# EAGLE board orbiphone (EAGLE 9.6.2)
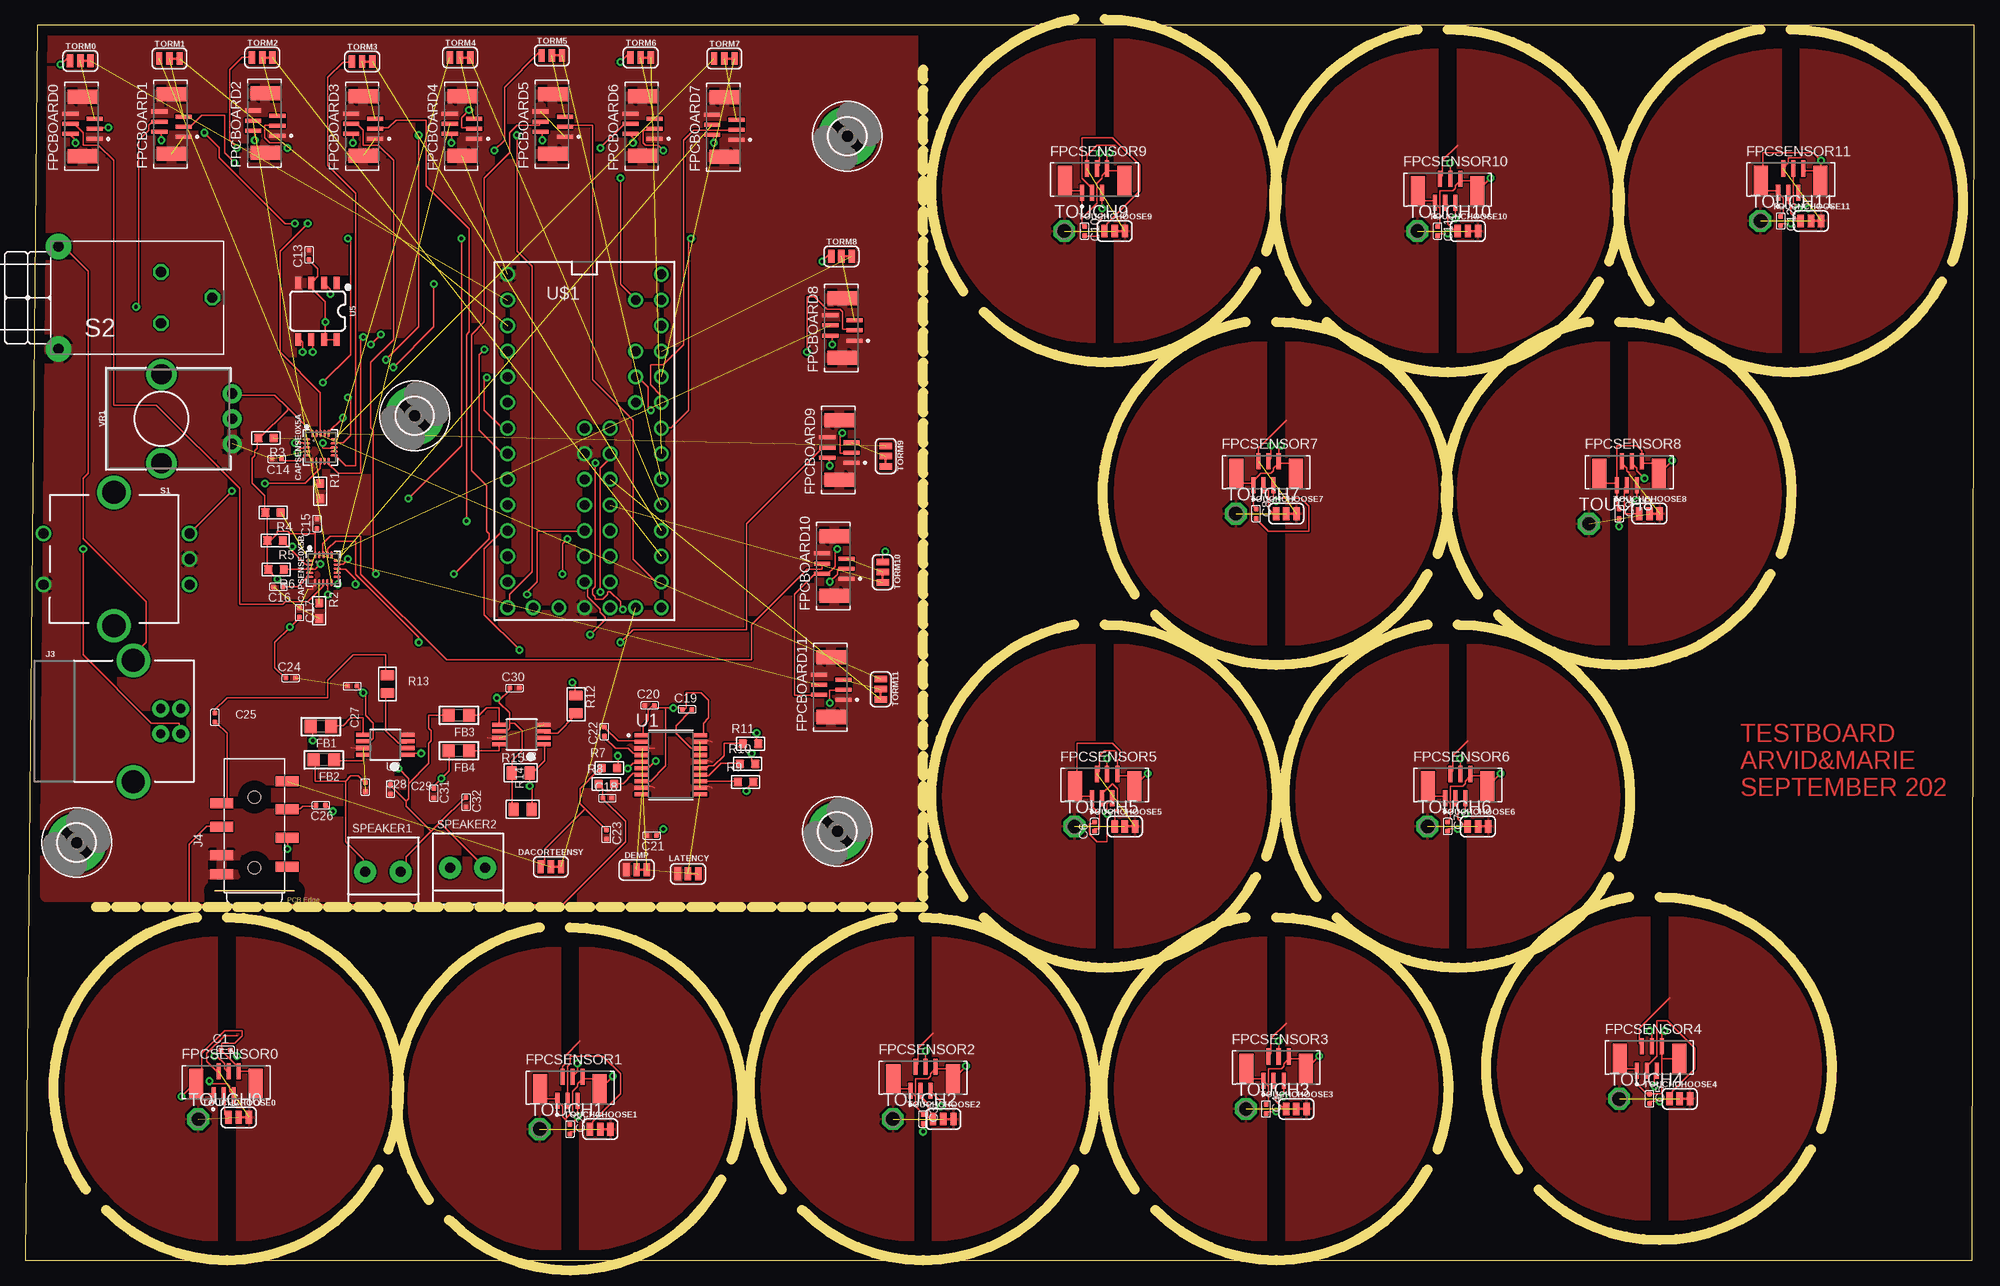
[diagram p1: board, top side]
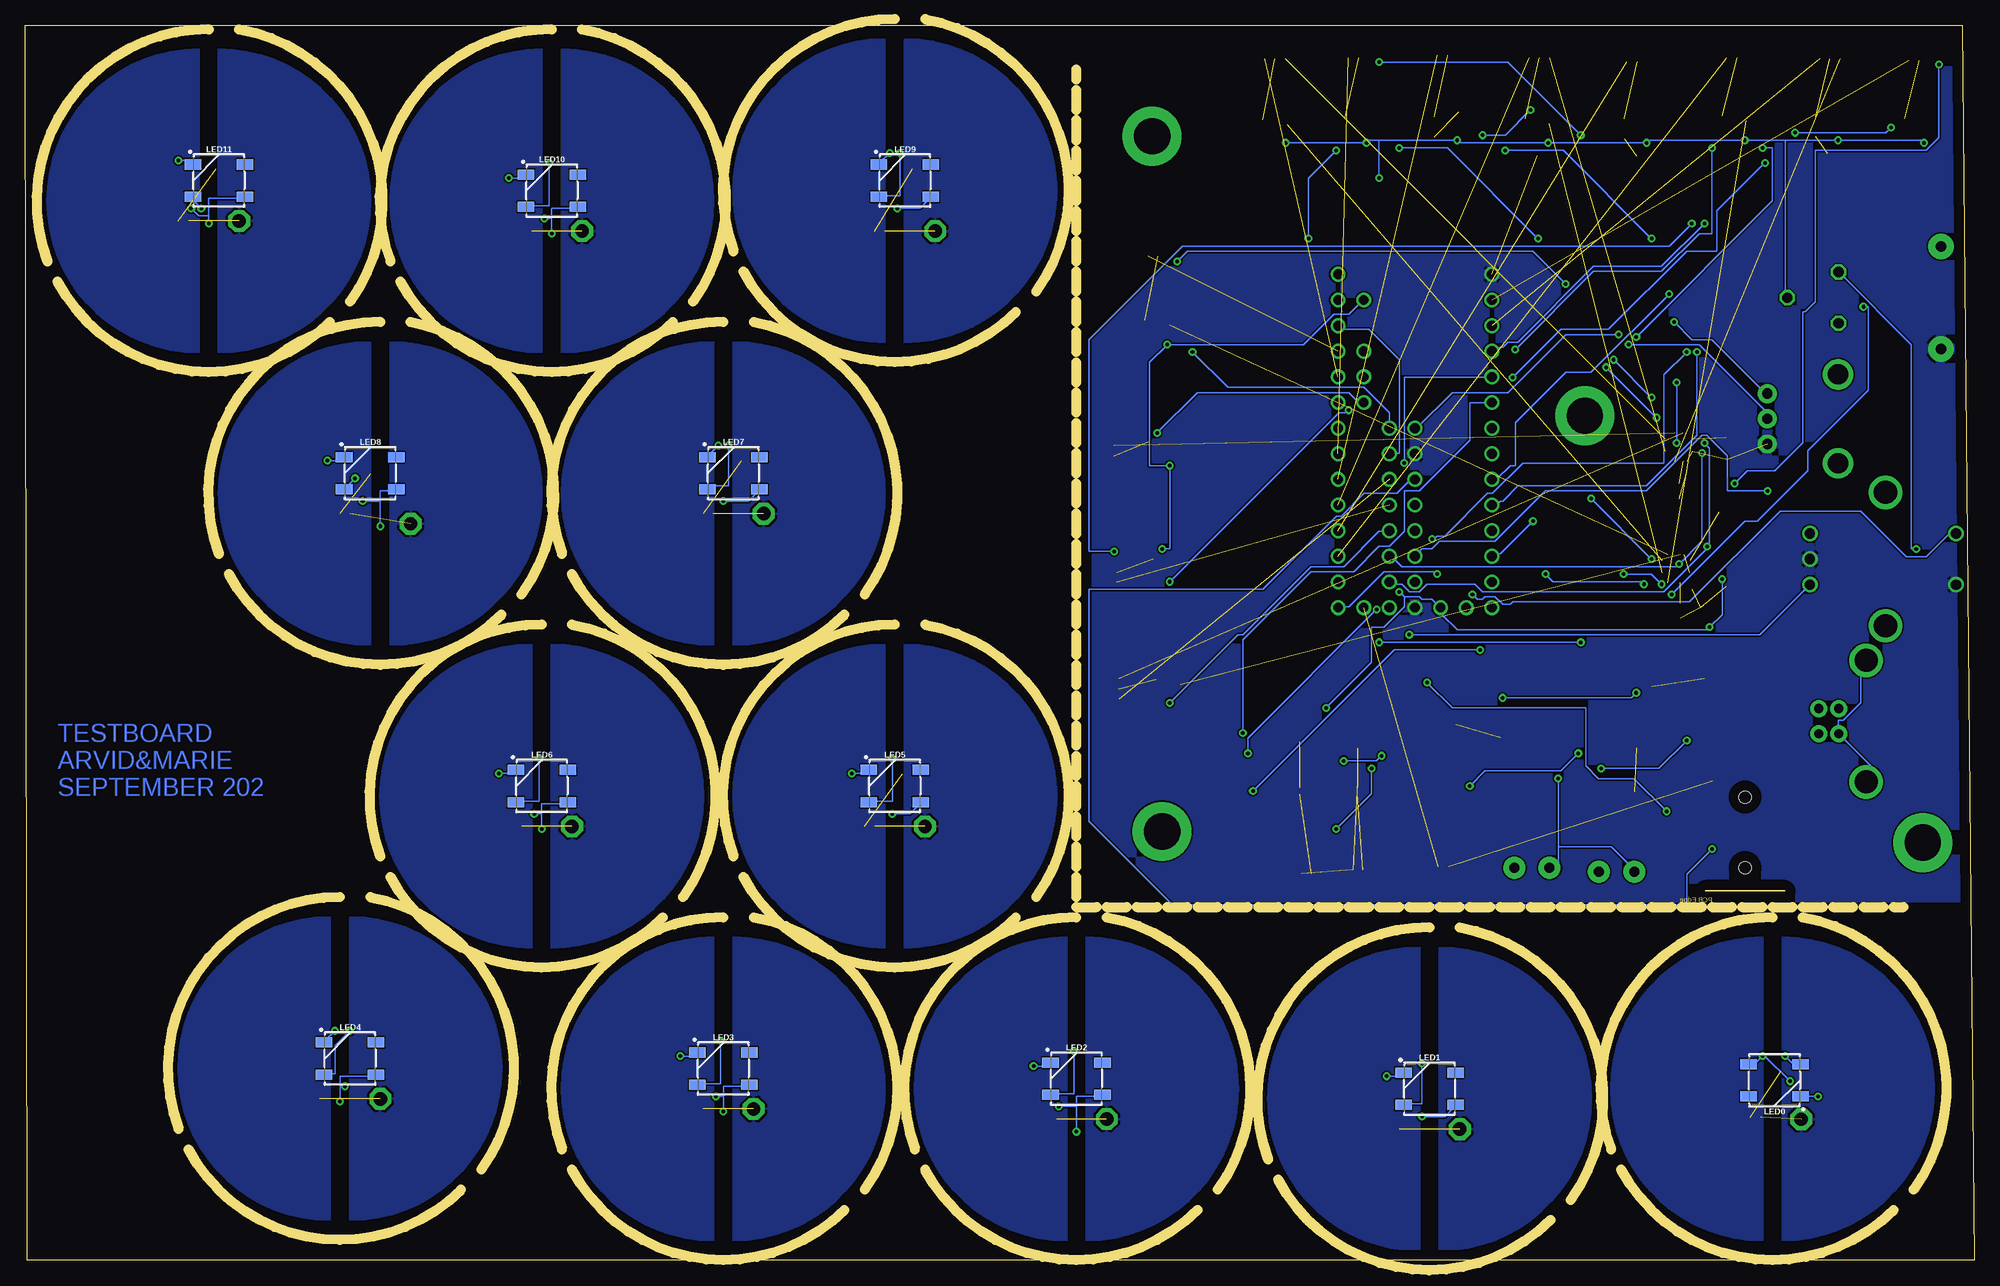
[diagram p2: board, bottom side, seen from below]

Size 193.2 x 122.4 mm. Coordinates in mm from the lower left corner, seen from the top.
Outline: 0,0 193,0 193.2,122.4 1.2,122.4 0,0
Copper layers (1*16): Top 0.035mm / dielectric 1.5mm / Bottom 0.035mm
Design rules "default": minimum track width 6mil, minimum drill 0.35mm, track to track 6mil, track to pad 6mil, pad to pad 6mil, via to via 6mil, smd to smd 6mil, copper to edge 40mil, drill to drill 6mil, minimum pad ring 10mil, minimum via ring 8mil, stop-mask expansion 4mil, vias tented up to drill 0mil, thermal gap 10mil
Milling: 92 lines

## Footprints (pad centres in the part's own frame; a part is rotated, then mirrored left to right if it is on the bottom)
C0402 = smd 0.5 x 0.5: 1 0,0.463; 2 0,-0.463
QFN-20 = smd 0.75 x 0.195: 1 -1.367,0.8; 2 -1.367,0.4; 3 -1.367,0; 4 -1.367,-0.4; 5 -1.367,-0.8; 11 1.375,-0.8; 12 1.375,-0.4; 13 1.375,0; 14 1.375,0.4; 15 1.375,0.8 | smd 0.195 x 0.75: 6 -0.795,-1.372; 7 -0.395,-1.372; 8 0.005,-1.372; 9 0.405,-1.372; 10 0.805,-1.372; 16 0.81,1.372; 17 0.41,1.372; 18 0.01,1.372; 19 -0.39,1.372; 20 -0.79,1.372
SMT-JUMPER_3_1-NC_TRACE_SILK = smd 0.635 x 1.27: 1 -1.016,0; 2 0,0; 3 1.016,0
_0805 = smd 1.2 x 1.3: 1 -1.016,0; 2 1.016,0
TE_1734742-6 = smd 0.4 x 1.6: 1 -1.25,-1.2; 2 -0.75,1.2; 3 -0.25,-1.2; 4 0.25,1.2; 5 0.75,-1.2; 6 1.25,1.2 | smd 1.4 x 2.9: S1 -2.95,0; S2 2.95,0
3,6-PAD = drill 3.6 pad 5.842: B3,6 0,0
USB-B-PTH = drill 0.914 pad 1.676: D+ 4,1.25; D- 5.981,1.25; GND 4,-1.25; VBUS 5.981,-1.25 | drill 2.286: SHLD1 1.282,-6.02; SHLD2 1.282,6.02
AUDIO8P-SMD-3.5-14.5X6X5MM = smd 1 x 2.25: 1 3.05,3.24; 2 4.95,3.24; 3 7.75,3.24; 4 12.26,-3.24; 5 3.81,-3.24; 6 6.66,-3.24; 7 9.51,-3.24; 8 10.1,3.24 | hole 1.2: 3.7,0; 10.7,0
WS2812B = smd 1.651 x 1: 1 2.577,-1.6; 2 2.577,1.6; 3 -2.577,1.6; 4 -2.577,-1.6
R0603 = smd 0.889 x 0.889: 1 0,0.762; 2 0,-0.762
R0805 = smd 1.397 x 1.016: 1 0,0.889; 2 0,-0.889
ROTARY_ENC_PLAIN = drill 1.016: A 7.493,-2.54; B 7.493,2.54; C 7.493,0; SW+ -6.985,2.54; SW- -6.985,-2.54 | drill 2.286: P$3 0,6.604; P$4 0,-6.604
316-917 = drill 1.016 octagon: 1 10.16,2.54; 2 15.24,0; 3 10.16,-2.54 | drill 1.016 pad 2.54: B 0,-5.08; B1 0,5.08
TERMBLOCK_1X2-3.5MM = drill 1 pad 2.184: 1 1.8,0; 2 -1.7,0
P1-13 = drill 1.321 pad 2.159 octagon: TP 0,0
SOP65P640X120-20N = smd 1.57 x 0.41: 1 -2.87,2.925; 2 -2.87,2.275; 3 -2.87,1.625; 4 -2.87,0.975; 5 -2.87,0.325; 6 -2.87,-0.325; 7 -2.87,-0.975; 8 -2.87,-1.625; 9 -2.87,-2.275; 10 -2.87,-2.925; 11 2.87,-2.925; 12 2.87,-2.275; 13 2.87,-1.625; 14 2.87,-0.975; 15 2.87,-0.325; 16 2.87,0.325; 17 2.87,0.975; 18 2.87,1.625; 19 2.87,2.275; 20 2.87,2.925
MSOP8_0.65MM = smd 0.4 x 1.4: 1 -0.975,-2.2; 2 -0.325,-2.2; 3 0.325,-2.2; 4 0.975,-2.2; 5 0.975,2.2; 6 0.325,2.2; 7 -0.325,2.2; 8 -0.975,2.2
SO08 = smd 0.6 x 1.2: 1 -1.905,-2.8; 2 -0.635,-2.8; 3 0.635,-2.8; 4 1.905,-2.8; 5 1.905,2.8; 6 0.635,2.8; 7 -0.635,2.8; 8 -1.905,2.8
TEENSY_3.0-3.2_ALL_PINS_&_PADS = drill 0.965: 0 -7.62,13.97; 1 -7.62,11.43; 2 -7.62,8.89; 3 -7.62,6.35; 3.3V 7.62,11.43; 3.3V1 -2.54,-16.51; 3.3V2 2.54,-1.27; 4 -7.62,3.81; 5 -7.62,1.27; 6 -7.62,-1.27; 7 -7.62,-3.81; 8 -7.62,-6.35; 9 -7.62,-8.89; 10 -7.62,-11.43; 11 -7.62,-13.97; 12 -7.62,-16.51; 13 7.62,-16.51; 14/A0 7.62,-13.97; 15/A1 7.62,-11.43; 16/A2 7.62,-8.89; 17/A3 7.62,-6.35; 18/A4 7.62,-3.81; 19/A5 7.62,-1.27; 20/A6 7.62,1.27; 21/A7 7.62,3.81; 22/A8 7.62,6.35; 23/A9 7.62,8.89; 24 0,-3.81; 25 0,-6.35; 26 0,-8.89; 27 0,-11.43; 28 0,-13.97; 29 2.54,-13.97; 30 2.54,-11.43; 31 2.54,-8.89; 32 2.54,-6.35; 33 2.54,-3.81; A10 5.08,6.35; A11 5.08,3.81; A12 0,1.27; A13 2.54,1.27; AGND 7.62,13.97; AREF 5.08,8.89; GND -7.62,16.51; GND1 0,-16.51; GND2 0,-1.27; PGM 2.54,-16.51; RESET/DAC 5.08,-16.51; VBAT -5.08,-16.51; VIN 7.62,16.51; VUSB 5.08,13.97
POT-PTH-ALPS-KIT = drill 1 pad 1.88: P$1 7,-2.5; P$2 7,0; P$3 7,2.5 | drill 2: P$4 0,-4.4; P$5 0,4.4

## Placement (x,y rotation side)
C1  1UF 6.3V  [C0402]  19.86,20.85 90 top
C2  1UF 6.3V  [C0402]  54,13 0 top
C3  1UF 6.3V  [C0402]  89,14 0 top
C4  1UF 6.3V  [C0402]  123,15 0 top
C5  1UF 6.3V  [C0402]  161,16 0 top
C6  1UF 6.3V  [C0402]  106,43 180 top
C7  1UF 6.3V  [C0402]  141,43 0 top
C8  1UF 6.3V  [C0402]  122,74 0 top
C9  1UF 6.3V  [C0402]  158,74 0 top
C10  1UF 6.3V  [C0402]  105,102 0 top
C11  1UF 6.3V  [C0402]  140,102 0 top
C12  1UF 6.3V  [C0402]  174,103 0 top
C13  0.1UF 6.3V  [C0402]  28.13,99.66 180 top
C14  0.1UF 6.3V  [C0402]  24.94,79.41 270 top
C15  0.1UF 6.3V  [C0402]  28.92,73.01 180 top
C16  0.1UF 6.3V  [C0402]  25.09,66.74 270 top
C17  0.1UF 6.3V  [C0402]  27.18,64.2 0 top
C18  2n2  [C0402]  57.7,45.8 90 top
C19  100nF 6.3V  [C0402]  65.6,54.6 90 top
C20  100nF 6.3V  [C0402]  61.9,55 90 top
C21  2u2  [C0402]  62.1,42.1 270 top
C22  2u2  [C0402]  57.4,52.4 180 top
C23  2n2  [C0402]  57.6,42.2 0 top
C24  100nF 6.3V  [C0402]  26.3,57.7 90 top
C25  1UF  [C0402]  18.8,53.8 0 top
C26  1UF  [C0402]  29.3,45.1 270 top
C27  10UF  [C0402]  32.4,56.9 270 top
C28  220pF  [C0402]  33.7,46.9 0 top
C29  220pF  [C0402]  36.2,46.7 0 top
C30  10UF  [C0402]  48.5,56.7 90 top
C31  220pF  [C0402]  40.5,46.3 0 top
C32  220pF  [C0402]  43.7,45.4 0 top
CAPSENSE0X5A  MPR121  [QFN-20]  29.26,80.57 0 top
CAPSENSE0X5B  MPR121  [QFN-20]  29.55,68.54 0 top
DACORTEENSY  JUMPER-SMT_3_1-NC_TRACE_SILK  [SMT-JUMPER_3_1-NC_TRACE_SILK]  52.1,39 0 top
DEMP  JUMPER-SMT_3_1-NC_TRACE_SILK  [SMT-JUMPER_3_1-NC_TRACE_SILK]  60.6,38.7 0 top
FB1  Ferrite  [_0805]  29.3,52.9 180 top
FB2  Ferrite  [_0805]  29.6,49.6 180 top
FB3  Ferrite  [_0805]  43,54 180 top
FB4  Ferrite  [_0805]  43,50.5 180 top
FPCBOARD0  1734742-6  [TE_1734742-6]  5.68,112.38 90 top
FPCBOARD1  1734742-6  [TE_1734742-6]  14.5,112.6 90 top
FPCBOARD2  1734742-6  [TE_1734742-6]  23.8,112.7 90 top
FPCBOARD3  1734742-6  [TE_1734742-6]  33.5,112.4 90 top
FPCBOARD4  1734742-6  [TE_1734742-6]  43.3,112.4 90 top
FPCBOARD5  1734742-6  [TE_1734742-6]  52.3,112.6 90 top
FPCBOARD6  1734742-6  [TE_1734742-6]  61.2,112.4 90 top
FPCBOARD7  1734742-6  [TE_1734742-6]  69.3,112.3 90 top
FPCBOARD8  1734742-6  [TE_1734742-6]  81,92.4 90 top
FPCBOARD9  1734742-6  [TE_1734742-6]  80.7,80.3 90 top
FPCBOARD10  1734742-6  [TE_1734742-6]  80.2,68.8 90 top
FPCBOARD11  1734742-6  [TE_1734742-6]  79.9,56.8 90 top
FPCSENSOR0  1734742-6  [TE_1734742-6]  19.91,17.54 0 top
FPCSENSOR1  1734742-6  [TE_1734742-6]  54,17 0 top
FPCSENSOR2  1734742-6  [TE_1734742-6]  89,18 0 top
FPCSENSOR3  1734742-6  [TE_1734742-6]  124,19 0 top
FPCSENSOR4  1734742-6  [TE_1734742-6]  161,20 0 top
FPCSENSOR5  1734742-6  [TE_1734742-6]  107,47 0 top
FPCSENSOR6  1734742-6  [TE_1734742-6]  142,47 0 top
FPCSENSOR7  1734742-6  [TE_1734742-6]  123,78 0 top
FPCSENSOR8  1734742-6  [TE_1734742-6]  159,78 0 top
FPCSENSOR9  1734742-6  [TE_1734742-6]  106,107 0 top
FPCSENSOR10  1734742-6  [TE_1734742-6]  141,106 0 top
FPCSENSOR11  1734742-6  [TE_1734742-6]  175,107 0 top
H1  MOUNT-PAD-ROUND3.6  [3,6-PAD]  5.1,41.4 180 top
H3  MOUNT-PAD-ROUND3.6  [3,6-PAD]  80.5,42.5 180 top
H4  MOUNT-PAD-ROUND3.6  [3,6-PAD]  38.6,83.7 180 top
H5  MOUNT-PAD-ROUND3.6  [3,6-PAD]  81.5,111.4 180 top
J3  USB_B_PTH  [USB-B-PTH]  9.44,53.43 0 top
J4  PJ-3536-L6S  [AUDIO8P-SMD-3.5-14.5X6X5MM]  22.72,35.21 90 top
LATENCY  JUMPER-SMT_3_1-NC_TRACE_SILK  [SMT-JUMPER_3_1-NC_TRACE_SILK]  65.7,38.3 0 top
LED0  WS2812B  [WS2812B]  19.81,17.85 180 bottom
LED1  WS2812B  [WS2812B]  54,17 0 bottom
LED2  WS2812B  [WS2812B]  89,18 0 bottom
LED3  WS2812B  [WS2812B]  124,19 0 bottom
LED4  WS2812B  [WS2812B]  161,20 0 bottom
LED5  WS2812B  [WS2812B]  107,47 0 bottom
LED6  WS2812B  [WS2812B]  142,47 0 bottom
LED7  WS2812B  [WS2812B]  123,78 0 bottom
LED8  WS2812B  [WS2812B]  159,78 0 bottom
LED9  WS2812B  [WS2812B]  106,107 0 bottom
LED10  WS2812B  [WS2812B]  141,106 0 bottom
LED11  WS2812B  [WS2812B]  174,107 0 bottom
R1  75K  [R0603]  29.25,76.23 180 top
R2  75K  [R0603]  29.15,64.37 180 top
R3  10K  [R0603]  23.87,81.5 90 top
R4  10K  [R0603]  24.57,74.12 90 top
R5  10K  [R0603]  24.77,71.34 90 top
R6  10K  [R0603]  24.87,68.46 90 top
R7  470  [R0603]  57.9,48.8 270 top
R8  470  [R0603]  57.6,47.2 270 top
R9  22R  [R0603]  71.4,47.4 270 top
R10  22R  [R0603]  71.6,49.2 270 top
R11  22R  [R0603]  71.9,51.2 270 top
R12  100R  [R0805]  54.6,55.1 0 top
R13  100R  [R0805]  35.9,57.1 0 top
R14  10K  [R0805]  49.3,44.7 90 top
R15  10K  [R0805]  49.1,48.3 90 top
S1  ENCODER-SWITCH  [ROTARY_ENC_PLAIN]  8.8,69.5 0 top
S2  [316-917]  3.3,95.4 0 top
SPEAKER1  [TERMBLOCK_1X2-3.5MM]  35.4,38.5 0 top
SPEAKER2  [TERMBLOCK_1X2-3.5MM]  43.8,38.9 0 top
TORM0  JUMPER-SMT_3_1-NC_TRACE_SILK  [SMT-JUMPER_3_1-NC_TRACE_SILK]  5.47,118.87 0 top
TORM1  JUMPER-SMT_3_1-NC_TRACE_SILK  [SMT-JUMPER_3_1-NC_TRACE_SILK]  14.3,119.1 0 top
TORM2  JUMPER-SMT_3_1-NC_TRACE_SILK  [SMT-JUMPER_3_1-NC_TRACE_SILK]  23.5,119.2 0 top
TORM3  JUMPER-SMT_3_1-NC_TRACE_SILK  [SMT-JUMPER_3_1-NC_TRACE_SILK]  33.4,118.8 0 top
TORM4  JUMPER-SMT_3_1-NC_TRACE_SILK  [SMT-JUMPER_3_1-NC_TRACE_SILK]  43.1,119.2 0 top
TORM5  JUMPER-SMT_3_1-NC_TRACE_SILK  [SMT-JUMPER_3_1-NC_TRACE_SILK]  52.2,119.4 0 top
TORM6  JUMPER-SMT_3_1-NC_TRACE_SILK  [SMT-JUMPER_3_1-NC_TRACE_SILK]  61,119.2 0 top
TORM7  JUMPER-SMT_3_1-NC_TRACE_SILK  [SMT-JUMPER_3_1-NC_TRACE_SILK]  69.3,119.1 0 top
TORM8  JUMPER-SMT_3_1-NC_TRACE_SILK  [SMT-JUMPER_3_1-NC_TRACE_SILK]  80.9,99.5 0 top
TORM9  JUMPER-SMT_3_1-NC_TRACE_SILK  [SMT-JUMPER_3_1-NC_TRACE_SILK]  85.3,79.7 270 top
TORM10  JUMPER-SMT_3_1-NC_TRACE_SILK  [SMT-JUMPER_3_1-NC_TRACE_SILK]  85,68.2 270 top
TORM11  JUMPER-SMT_3_1-NC_TRACE_SILK  [SMT-JUMPER_3_1-NC_TRACE_SILK]  84.8,56.6 270 top
TOUCH0  TPPAD1-13  [P1-13]  17.16,13.99 0 top
TOUCH1  TPPAD1-13  [P1-13]  51,13 0 top
TOUCH2  TPPAD1-13  [P1-13]  86,14 0 top
TOUCH3  TPPAD1-13  [P1-13]  121,15 0 top
TOUCH4  TPPAD1-13  [P1-13]  158,16 0 top
TOUCH5  TPPAD1-13  [P1-13]  104,43 0 top
TOUCH6  TPPAD1-13  [P1-13]  139,43 0 top
TOUCH7  TPPAD1-13  [P1-13]  120,74 0 top
TOUCH8  TPPAD1-13  [P1-13]  155,73 0 top
TOUCH9  TPPAD1-13  [P1-13]  103,102 0 top
TOUCH10  TPPAD1-13  [P1-13]  138,102 0 top
TOUCH11  TPPAD1-13  [P1-13]  172,103 0 top
TOUCHCHOOSE0  JUMPER-SMT_3_1-NC_TRACE_SILK  [SMT-JUMPER_3_1-NC_TRACE_SILK]  21.16,14.17 0 top
TOUCHCHOOSE1  JUMPER-SMT_3_1-NC_TRACE_SILK  [SMT-JUMPER_3_1-NC_TRACE_SILK]  57,13 0 top
TOUCHCHOOSE2  JUMPER-SMT_3_1-NC_TRACE_SILK  [SMT-JUMPER_3_1-NC_TRACE_SILK]  91,14 0 top
TOUCHCHOOSE3  JUMPER-SMT_3_1-NC_TRACE_SILK  [SMT-JUMPER_3_1-NC_TRACE_SILK]  126,15 0 top
TOUCHCHOOSE4  JUMPER-SMT_3_1-NC_TRACE_SILK  [SMT-JUMPER_3_1-NC_TRACE_SILK]  164,16 0 top
TOUCHCHOOSE5  JUMPER-SMT_3_1-NC_TRACE_SILK  [SMT-JUMPER_3_1-NC_TRACE_SILK]  109,43 0 top
TOUCHCHOOSE6  JUMPER-SMT_3_1-NC_TRACE_SILK  [SMT-JUMPER_3_1-NC_TRACE_SILK]  144,43 0 top
TOUCHCHOOSE7  JUMPER-SMT_3_1-NC_TRACE_SILK  [SMT-JUMPER_3_1-NC_TRACE_SILK]  125,74 0 top
TOUCHCHOOSE8  JUMPER-SMT_3_1-NC_TRACE_SILK  [SMT-JUMPER_3_1-NC_TRACE_SILK]  161,74 0 top
TOUCHCHOOSE9  JUMPER-SMT_3_1-NC_TRACE_SILK  [SMT-JUMPER_3_1-NC_TRACE_SILK]  108,102 0 top
TOUCHCHOOSE10  JUMPER-SMT_3_1-NC_TRACE_SILK  [SMT-JUMPER_3_1-NC_TRACE_SILK]  143,102 0 top
TOUCHCHOOSE11  JUMPER-SMT_3_1-NC_TRACE_SILK  [SMT-JUMPER_3_1-NC_TRACE_SILK]  177,103 0 top
U1  PCM5102APWR  [SOP65P640X120-20N]  64,49.1 0 top
U2  PAM8302AASCR  [MSOP8_0.65MM]  35.7,51.1 90 top
U3  PAM8302AASCR  [MSOP8_0.65MM]  49.2,52.1 90 top
U5  4MB Flash  [SO08]  28.98,94.06 180 top
U$1  TEENSY_3.1-3.2_ALL_PINS&PADS  [TEENSY_3.0-3.2_ALL_PINS_&_PADS]  55.44,81.2 0 top
VR1  10k  [POT-PTH-ALPS-KIT]  13.5,83.4 0 top

## Tracks (layer width: path | path; a pad name or v marks a point on that pad's centre or on a via)
3.3V  (via drill 0.35)  (3 unrouted)
  Top 0.152: C24.1 25.75,57.75 24.75,58.75 24.75,61.25 v26.25,62.75 27,63.5 C17.2 | 28.75,72 28.75,70 CAPSENSE0X5B.20 | 28.75,72 28.75,72.5 C15.1 | R5.1 24,71.25 24,68.5 R6.1 24.25,68.25 v25,67.5 | R5.1 24,71.5 24,74 R4.1 23.75,74.25 23.75,75.75 22.5,77 22.5,79.5 22.75,79.75 22.75,80.25 23,80.5 23,81.5 R3.1 23.25,81.5 26,84.25 26,84.5 | 28.75,72 26.25,72 26,72.25 25,72.25 25,72 24.25,71.25 R5.1 | U5.8 30.75,91.25 29.75,91.25 U5.7 29.75,91.5 v29.75,93 29.75,95 28.5,96.25 28.5,96.75 U5.3 28.5,97 29,97.5 29,98.25 28.25,99 C13.1 | 26,84.5 24.75,85.75 20.5,85.75 VR1.P$3 | 26,84.5 28.5,82 CAPSENSE0X5A.20 | U1.1 61.25,52 61.25,53 61.75,53.5 61.75,54.5 62.25,55 C20.2 62.5,55 62.5,54.75 63.5,54.75 | 63.5,54.75 v64.25,54.75 65,54.75 C19.1 65.25,54.5 65.5,54.75 65.5,56.25 67,56.25 67.75,55.5 67.75,53.75 67.25,53.25 67.25,52.25 67,52 U1.20 | 63.5,54.75 63.5,49 62,47.5 61.25,47.5 U1.8 | v57,66.25 57,78.5 57.75,79.25 57.75,79.75 U$1.3.3V2
  Bottom 0.152: v25,67.5 25,64 v26.25,62.75 26.5,62.5 51.25,62.5 52.75,64 52.75,64.5 U$1.3.3V1 53,64.75 53.75,65.5 54.75,65.5 55,65.75 56.5,65.75 | v29.75,93 28,91.25 26,91.25 20.75,86 20.5,86 VR1.P$3 | v57,66.25 56.5,65.75 | U$1.3.3V 63,92.5 62.75,92.25 60,92.25 57,89.25 57,80 57.75,80 U$1.3.3V2 | v64.25,54.75 59.75,59.25 59.75,62.75 58.5,62.75 56.5,64.75 56.5,65.75
5V  (via drill 0.35)
  Top 0.152: 79,68 78.25,68 76.25,66 76.25,56 78.5,56 FPCBOARD11.2 | v79.75,78.75 79.75,79.25 79.5,79.5 FPCBOARD9.2 | v80.5,70.5 80.25,70.25 80.25,68.75 79.5,68 79,68 | 79,68 FPCBOARD10.2 | v80,90.75 80,91.5 FPCBOARD8.2 | v5,110.75 5,111 4.5,111.5 FPCBOARD0.2 | v13.5,111 13.5,111.75 FPCBOARD1.2 | v22.75,111 22.75,112 FPCBOARD2.2 | v32.5,110.75 32.5,111.5 FPCBOARD3.2 | v42.25,110.75 42.25,111.5 FPCBOARD4.2 | v51.25,111 51.25,111.75 FPCBOARD5.2 | v60.25,110.75 60.25,111.25 60,111.5 FPCBOARD6.2 | v68.25,110.75 68.25,111.5 FPCBOARD7.2 | v59,107.25 59,96.75 60.5,95.25 U$1.VUSB
  Bottom 0.152: v80.5,70.5 79.75,70.5 v79.75,78.75 81.75,78.75 81.75,89 v80,90.75 66.5,90.75 63.5,93.75 62,93.75 60.75,95 U$1.VUSB | v5,110.75 5.25,111 v13.5,111 18.75,111 | 18.75,111 v22.75,111 32.25,111 v32.5,110.75 v42.25,110.75 51,110.75 v51.25,111 59,111 | 59,111 60,111 v60.25,110.75 v68.25,110.75 | 18.75,111 18.75,95.5 S2.2 | 59,111 v59,107.25
AMPL
  Top 0.152: C25.2 19,53.25 20,52.25 20,45.75 19.5,45.25 J4.8
AMPR
  Top 0.152: C26.2 28.75,45 27.5,45 27.25,44.75 26,44.75 J4.7
AUDIOOUTTEENSY  (1 unrouted)
ENCA  (via drill 0.35)
  Top 0.152: v56,62 57.5,63.5 57.5,63.75 57,64.25 57,64.5 55.75,65.75 55.75,66.75 55.5,67 U$1.28
  Bottom 0.152: v56,62 21.25,62 16.5,66.75 S1.A
ENCB  (via drill 0.35)
  Top 0.152: v20.5,76.25 16.5,72.25 S1.B
  Bottom 0.152: v20.5,76.25 24.5,76.25 24.5,79.75 26.5,81.75 27,81.75 32.5,76.25 42.5,76.25 47.5,71.25 53,71.25 53.75,70.5 54.75,70.5 55.25,70 U$1.27
ENCBUT  (via drill 0.35)
  Top 0.152: v49.75,66 49.75,66.25 50.75,67.25 50.75,72.25 55.25,72.25 U$1.26
  Bottom 0.152: v49.75,66 49.25,65.5 48.75,65.5 48.5,65.75 47.5,65.75 46.75,65 46,65 45.75,65.25 28.25,65.25 19.25,74.25 11.25,74.25 6.75,69.75 4.75,69.75 2.5,72 2,72 S1.SW+
GND  (17 unrouted)
  Top 0.152: CAPSENSE0X5B.6 28.75,67 28.5,66.75 28.5,66.5 28,66.49 | CAPSENSE0X5A.6 28.5,79 28.5,78.75 28.46,78.27 | U2.7 33.5,50.75 32.75,50.75 32.33,50.77 | U2.4 38,52.25 37.9,52.28 | U3.7 47,51.75 46.25,51.75 45.83,51.77 | U3.4 51.5,53.25 51.4,53.28 | U1.9 61.25,47 62,47 62.36,46.83 | U1.3 61.25,50.75 62,50.75 62.36,50.73 | U1.12 67,47 67.75,47 68.1,46.83 | U1.16 67,49.5 67.75,49.5 68.1,49.42 | U1.19 67,51.5 67.75,51.5 68.1,51.38
  pour Top: 2,122 88,122 88,36 2,36
  pour Bottom: 2,122 87,122 87,36 1,36 1,122
I2SLRCK  (via drill 0.35)
  Top 0.152: v72.5,52.25 72.5,51.25 R11.1
  Bottom 0.152: v72.5,52.25 72.5,61.5 65.75,68.25 61.5,68.25 59,70.75 58,70.75 56.5,72.25 56.5,76.25 55,76.25 50,81.25 50,85 48,85 U$1.4
I2STX  (via drill 0.35)
  Top 0.152: v72,50.25 72,49.5 72.25,49.25 R10.1 | v59.25,64.5 59,64.75 59,65.25 58,66.25 57.75,66.25 57.75,66 57.25,65.5 56.5,65.5 56.5,65.75 56.25,66 56.25,66.5 56.5,66.75 v56.5,79
  Bottom 0.152: v72,50.25 72,51.75 v59.25,64.5 | v56.5,79 56.5,87.5 48,87.5 U$1.3
IRQA  (1 unrouted)
IRQB  (1 unrouted)
IS2BCLK  (via drill 0.35)
  Top 0.152: v71.5,46.5 71.5,46.75 72,47.25 R9.1 | v49,60.5 45.5,64 45.5,70.5 47.25,72.25 47.75,72.25 U$1.9
  Bottom 0.152: v71.5,46.5 57.5,60.5 v49,60.5
JACKSENS  (via drill 0.35)
  Top 0.152: v26,40.75 26,41.75 J4.6
  Bottom 0.152: v26,40.75 28.5,38.25 28.5,35.25 79.5,35.25 87.75,43.5 87.75,66.5 70.5,66.5 63.25,73.75 62.75,73.75 60.5,76 57.25,76 56,77.25 55.5,77.25 U$1.24
LED0  (via drill 0.35)
  Top 0.152: v8.25,112.25 7,112.25 FPCBOARD0.3 | v17.75,111.75 19.25,110.25 19.25,109.25 25.75,102.75 v26.75,102.75
  Bottom 0.152: v8.25,112.25 8.75,111.75 v17.75,111.75 | v26.75,102.75 31,98.5 37.75,98.5 45.25,91 46.25,91 46.75,90.5 47,90.5 47.25,90.25 47.75,90.25 U$1.2
LED1  (via drill 0.35)
  Top 0.152: v20.75,108.75 19.75,109.75 19.75,113.5 17.5,113.5 16.5,112.5 15.75,112.5 FPCBOARD1.3 | v45.75,87.5 45.5,87.25 45.5,84.25 47.25,82.5 47.75,82.5 U$1.5
  Bottom 0.152: v20.75,108.75 25.5,104 25.5,100 28.5,100 36.25,92.25 41,92.25 v45.75,87.5
LED2  (via drill 0.35)
  Top 0.152: v26,110.25 25.5,110.75 24.25,110.75 23.75,111.25 23.75,112.5 25,112.5 FPCBOARD2.3 | v45.5,90.25 45,89.75 45,82.25 47.25,80 47.75,80 U$1.6
  Bottom 0.152: v26,110.25 26,101.75 27.25,101.75 31,98 37.75,98 v45.5,90.25
LED3  (via drill 0.35)
  Top 0.152: v43.75,73.25 43.75,91.75 44,92 44,102.25 39.75,106.5 39.75,113 36.75,113 36,112.25 34.75,112.25 FPCBOARD3.3
  Bottom 0.152: v43.75,73.25 47,70 47.75,70 U$1.10
LED4  (via drill 0.35)
  Top 0.152: v44,114 43.25,113.25 43.25,112.25 44.5,112.25 FPCBOARD4.3 | v48.75,111.5 48.75,100 50.25,98.5 50.25,68.25 48,66 48,64.75 U$1.12
  Bottom 0.152: v44,114 46.5,111.5 v48.75,111.5
LED5
  Top 0.152: FPCBOARD5.3 53.5,112.5 56.25,112.5 56.25,87.25 60.25,83.25 60.25,69.5 62.5,67.25 63,67.25 U$1.14/A0
LED6  (via drill 0.35)
  Top 0.152: v63.25,110 62.75,110.5 61.5,110.5 61.25,110.75 61.25,112 62.25,112 FPCBOARD6.3 | v66,101.25 65.75,101 65.75,84.25 64,82.5 63.25,82.5 U$1.20/A6
  Bottom 0.152: v63.25,110 66,107.25 v66,101.25
LED7
  Top 0.152: FPCBOARD7.3 70.5,112 66.25,112 65.25,111 65.25,90.75 63.25,88.75 62,88.75 62,86.75 63,85.75 63,85.25 U$1.21/A7
LED8  (via drill 0.35)
  Top 0.152: v77.5,90 77.5,95.5 78.25,95.5 79.5,94.25 80.75,94.25 81,94 81,92.25 82,92.25 FPCBOARD8.3
  Bottom 0.152: v77.5,90 74,86.5 60.5,86.5 58,84 58,82.5 U$1.A13
LED9  (via drill 0.35)
  Top 0.152: v81,82 80.75,81.75 80.75,80 81.75,80 FPCBOARD9.3
  Bottom 0.152: v81,82 77,86 62,86 61.25,85.25 60.75,85.25 U$1.A11
LED10  (via drill 0.35)
  Top 0.152: v79.75,67.25 80.5,68 80.5,68.5 81.25,68.5 FPCBOARD10.3 | v62,84.25 61.75,84.5 61.75,86.5 60.75,87.5 U$1.A10
  Bottom 0.152: v79.75,67.25 63,84 62.25,84 v62,84.25
LED11  (via drill 0.35)
  Top 0.152: v79.75,55.25 79.75,56.5 81,56.5 FPCBOARD11.3
  Bottom 0.152: v79.75,55.25 73,62 72.5,62 65.75,68.75 62.5,68.75 59,72.25 58,72.25 U$1.31
LOUT  (1 unrouted)
MISO  (via drill 0.35)
  Top 0.152: v27.5,90 27.5,91 27.25,91.25 U5.5
  Bottom 0.152: v27.5,90 27.5,81.75 32.5,76.75 45.25,76.75 46.75,75.25 47,75.25 47.25,75 47.75,75 U$1.8
MOSI  (via drill 0.35)
  Top 0.152: v30.25,95.75 30.25,96.25 29.75,96.75 U5.2
  Bottom 0.152: v30.25,95.75 38,88 40.5,88 45.5,83 45.5,78.75 46,78.75 47.25,77.5 47.75,77.5 U$1.7
N$1  (via drill 0.35)
  Top 0.152: FPCSENSOR0.1 18.5,16.5 17,16.5 17,17.5 FPCSENSOR0.S1 | v15.5,16.25 16.75,17.5 FPCSENSOR0.S1 | FPCSENSOR0.S2 22.75,17.75 22.75,18.75 21.25,18.75 FPCSENSOR0.6 21,18.75 21,19.25 19.5,20.75 C1.1 19.5,21 19.5,21.5 20.75,21.5 21.5,22.25 21.5,22.75 19.75,22.75 17.5,20.5 17.5,18.25 17,17.75 FPCSENSOR0.S1
  Top 0.254: 21.18,18.74 FPCSENSOR0.6
  Bottom 0.152: v15.5,16.25 LED0.3
N$2  (via drill 0.35)
  Top 0.152: 55.25,18 56.75,18 56.75,17 FPCSENSOR1.S2 57,17 v58.25,18.25 | 53.5,14 53.25,14.25 53.25,15.25 52.75,15.75 FPCSENSOR1.1 52.75,16 51.25,16 51.25,17 FPCSENSOR1.S1 | 53.5,14 54,13.5 C2.1 | 55.25,18 54.75,17.5 54.75,17.25 54.25,16.75 54.25,14.75 53.5,14 | 55.25,18 FPCSENSOR1.6
  Bottom 0.152: v58.25,18.25 57,18.25 56.75,18.5 LED1.3
N$3  (via drill 0.35)
  Top 0.152: v21,20.25 20.5,20.75 C1.2 | FPCSENSOR0.5 20.25,16.75 20.25,17.25 20,17.5 18.25,17.5 v18.25,17.75
  Bottom 0.152: LED0.1 22.25,19.5 21.75,19.5 v21,20.25 20.75,20.25 v18.25,17.75
N$4  (via drill 0.35)
  Top 0.152: v18.75,20.25 19,20.25 19.75,19.5 19.75,19 20,18.75 FPCSENSOR0.4
  Bottom 0.152: v18.75,20.25 18,19.5 17.25,19.5 LED0.4
N$5  (via drill 0.35)
  Top 0.152: 54.5,14.25 54.5,14.5 54.75,14.75 FPCSENSOR1.5 | 54.5,14.25 54.5,12.75 54,12.75 C2.2 | 54.5,14.25 v54.75,14.25
  Bottom 0.152: v54.75,14.25 52.5,14.25 51.5,15.25 LED1.1
N$6  (via drill 0.35)
  Top 0.152: v54.75,19.5 54.75,18.75 54.25,18.25 FPCSENSOR1.4
  Bottom 0.152: v54.75,19.5 54.75,15.5 56.5,15.5 LED1.4
N$9
  Top 0.152: FPCSENSOR1.3 53.75,19.25 54,19.5 54,20.25 57.25,20.25 59,18.5 59,16.5 56.25,13.75 56.25,13.25 56,13 TOUCHCHOOSE1.1
N$10  (via drill 0.35)
  Top 0.152: 90.25,19 91.75,19 91.75,18 FPCSENSOR2.S2 92,18 v93.25,19.25 | 88.25,16.25 88.25,15.25 89,14.5 C3.1 | 88.25,16.25 87.75,16.75 FPCSENSOR2.1 87.75,17 86.25,17 86.25,18 FPCSENSOR2.S1 | 90.25,19 89.75,18.5 89.75,18.25 89.5,18 88.25,18 88.25,16.25 | 90.25,19 FPCSENSOR2.6
  Bottom 0.152: v93.25,19.25 92,19.25 91.75,19.5 LED2.3
N$11  (via drill 0.35)
  Top 0.152: v89,12.75 C3.2 | v90.75,15.25 90.75,15.75 89.75,16.75 FPCSENSOR2.5
  Bottom 0.152: 89,15.25 89,16.25 86.5,16.25 LED2.1 | 89,15.25 v89,12.75 | 89,15.25 v90.75,15.25
N$12  (via drill 0.35)
  Top 0.152: v89.25,20.75 FPCSENSOR2.4
  Bottom 0.152: v89.25,20.75 89.25,16.5 91.5,16.5 LED2.4
N$15
  Top 0.152: FPCSENSOR2.3 88.75,16.25 89.5,15.5 89.5,14.25 89.75,14 TOUCHCHOOSE2.1
N$16  (via drill 0.35)
  Top 0.152: 125.25,20 126.75,20 126.75,19 FPCSENSOR3.S2 127,19 v128.25,20.25 | 123.25,17.25 123.25,15.75 123,15.5 C4.1 | 123.25,17.25 122.75,17.75 FPCSENSOR3.1 122.75,18 121.25,18 121.25,19 FPCSENSOR3.S1 | 125.25,20 124.75,19.5 124.75,19.25 124.5,19 123.25,19 123.25,17.25 | 125.25,20 FPCSENSOR3.6
  Bottom 0.152: v128.25,20.25 127,20.25 126.75,20.5 LED3.3
N$17  (via drill 0.35)
  Top 0.152: v124,14.75 123,14.75 C4.2 | v124.75,16.25 FPCSENSOR3.5
  Bottom 0.152: 124,16.25 124,17.25 121.5,17.25 LED3.1 | 124,16.25 v124,14.75 | 124,16.25 v124.75,16.25
N$18  (via drill 0.35)
  Top 0.152: v124.25,21.75 FPCSENSOR3.4
  Bottom 0.152: v124.25,21.75 124.25,17.5 126.5,17.5 LED3.4
N$21
  Top 0.152: TOUCHCHOOSE3.1 124.75,15 124,15.75 124,17.5 123.75,17.75 FPCSENSOR3.3
N$22  (via drill 0.35)
  Top 0.152: FPCSENSOR4.S1 158.25,20 158.25,19 159.75,19 FPCSENSOR4.1 159.75,17.5 161,16.25 C5.1 161,16.5 162.25,16.5 162.25,20 | 162.25,20 FPCSENSOR4.6 162.25,22.5 v162.5,22.75 | 162.25,20 FPCSENSOR4.S2
  Bottom 0.152: v162.5,22.75 163.5,21.75 LED4.3
N$23  (via drill 0.35)
  Top 0.152: v162,15.75 161,15.75 C5.2 | v161.5,17.25 161.5,18.5 161.75,18.75 FPCSENSOR4.5
  Bottom 0.152: 162,17.25 162,18.25 158.5,18.25 LED4.1 | 162,17.25 v162,15.75 | 162,17.25 v161.5,17.25
N$24  (via drill 0.35)
  Top 0.152: FPCSENSOR4.4 161.25,22.5 v161,22.75
  Bottom 0.152: v161,22.75 162.5,21.25 162.5,18.5 163.5,18.5 LED4.4
N$27
  Top 0.152: FPCSENSOR4.3 160.75,19.25 161.75,20.25 161.75,23.75 162.75,23.75 165.5,21 165.5,19 163.25,16.75 163.25,16.25 163,16 TOUCHCHOOSE4.1
N$28  (via drill 0.35)
  Top 0.152: v111.25,48.25 110,47 FPCSENSOR5.S2 109.75,47 109.75,48 108.25,48 FPCSENSOR5.6 108.25,49.5 108.5,49.75 108.5,50.5 107.75,51.25 104.25,51.25 104.25,47 | C6.1 106,42.75 106.5,42.75 106.5,44.25 105.75,45 FPCSENSOR5.1 105.75,46 104.25,46 104.25,47 | 104.25,47 FPCSENSOR5.S1
  Bottom 0.152: v111.25,48.25 110,48.25 109.75,48.5 LED5.3
N$29  (via drill 0.35)
  Top 0.152: C6.2 106,43.25 105.5,43.25 105.5,42.25 106.25,41.5 107.25,41.5 v107.25,44.25 107.25,45.25 107.75,45.75 FPCSENSOR5.5
  Bottom 0.152: v107.25,44.25 105.5,44.25 104.5,45.25 LED5.1
N$30  (via drill 0.35)
  Top 0.152: v107.25,49.75 FPCSENSOR5.4
  Bottom 0.152: v107.25,49.75 107.25,45.5 109.5,45.5 LED5.4
N$33
  Top 0.152: FPCSENSOR5.3 106.75,46.25 107.75,47.25 108.25,46.75 108.25,44.75 108,44.5 108,43 TOUCHCHOOSE5.1
N$34  (via drill 0.35)
  Top 0.152: 143.25,48 144.75,48 144.75,47 FPCSENSOR6.S2 145,47 v146.25,48.25 | 141.25,45.25 141.25,43.75 141,43.5 C7.1 | 141.25,45.25 140.75,45.75 FPCSENSOR6.1 140.75,46 139.25,46 139.25,47 FPCSENSOR6.S1 | 143.25,48 142.75,47.5 142.75,47.25 142.5,47 141.25,47 141.25,45.25 | 143.25,48 FPCSENSOR6.6
  Bottom 0.152: v146.25,48.25 145,48.25 144.75,48.5 LED6.3
N$35  (via drill 0.35)
  Top 0.152: v142,42.75 141,42.75 C7.2 | v142.75,44.25 FPCSENSOR6.5
  Bottom 0.152: 142,44.25 142,45.25 139.5,45.25 LED6.1 | 142,44.25 v142,42.75 | 142,44.25 v142.75,44.25
N$36  (via drill 0.35)
  Top 0.152: v142.25,49.75 FPCSENSOR6.4
  Bottom 0.152: v142.25,49.75 142.25,45.5 144.5,45.5 LED6.4
N$37
  Top 0.152: C14.1 25.5,79.25 27.25,79.25 27.75,79.75 CAPSENSE0X5A.5
N$38  (1 unrouted)
N$42
  Top 0.152: S2.B1 3.5,100.25 4.25,100.25 4.25,100 6.25,98 6.25,78 5.75,77.5 5.75,71.5 12,65.25 12,61.25 10.75,60 10.75,59.5 J3.SHLD2
  Bottom 0.152: J3.SHLD1 10.5,47.5 10.25,47.5 10.25,49 13.25,52 J3.GND 13.5,52.25 13.5,53.5 13,53.5 11.25,55.25 11.25,59.25 10.75,59.25 J3.SHLD2
N$43  (via drill 0.35)
  Top 0.152: v5.75,70.5 5.75,60 12.5,53.25 15.25,53.25 15.25,52.25 J3.VBUS
  Bottom 0.152: v5.75,70.5 6.25,70.5 6.25,90.75 13.25,97.75 S2.1
N$53
  Top 0.152: C16.1 25.75,66.75 27,66.75 28,67.75 CAPSENSE0X5B.5
N$54  (1 unrouted)
N$66
  Top 0.152: R10.2 70.75,49.25 69,49.25 67.75,48 67,48 U1.14
N$67
  Top 0.152: R9.2 70.5,47.5 67,47.5 U1.13
N$68
  Top 0.152: R11.2 71,51.25 69.25,51.25 69.25,50 68.25,49 67.75,49 67.5,48.75 67,48.75 U1.15
N$69
  Top 0.152: C19.2 66,54.5 64.5,53 64.5,52.25 66,50.75 66.75,50.75 U1.18
N$70
  Top 0.152: C22.2 57.5,52.75 58.75,51.5 61,51.5 U1.2
N$71
  Top 0.152: C22.1 57.5,51.75 58.5,50.75 59.75,50.75 60.25,50.25 61,50.25 U1.4
N$72  (via drill 0.35)
  Top 0.152: v63.25,42.75 62.75,42.25 C21.1 | v59.75,48.75 60.25,49.25 61,49.25 U1.5
  Bottom 0.152: v63.25,42.75 59.75,46.25 v59.75,48.75
N$73  (via drill 0.35)
  Top 0.152: v58.75,50 58.75,49 R7.1 | v62.5,49.5 61.75,48.75 61.25,48.75 U1.6
  Bottom 0.152: v58.75,50 59.25,49.5 v62.5,49.5
N$74
  Top 0.152: R8.1 58.5,47.25 59.25,47.25 60.25,48.25 61,48.25 U1.7
N$75  (1 unrouted)
N$76  (1 unrouted)
N$77
  Top 0.152: R12.2 54.5,54 52.75,52.25 51.5,52.25 U3.3
N$78
  Top 0.152: R13.2 35.75,56 35.75,52.5 37,51.25 37.75,51.25 U2.3
N$79
  Top 0.152: FB4.1 47,50.5 U3.8
N$80
  Top 0.152: U2.8 33.5,49.5 30.75,49.5 FB2.1
N$81
  Top 0.152: U2.5 33.5,53.75 32.25,53.75 31.5,53 30.5,53 FB1.1
N$82
  Top 0.152: C25.1 18.75,54.5 20,55.75 30,55.75 30,57.5 32.5,60 35.75,60 35.75,58 R13.1
N$83
  Top 0.152: FB3.1 45,54 45.75,54.75 47,54.75 U3.5
N$84  (via drill 0.35)
  Top 0.152: v30.5,44.5 30,45 C26.1 | v54.25,57.25 54.5,57 54.5,56 R12.1
  Bottom 0.152: v30.5,44.5 33.75,47.75 37.25,47.75 38.5,49 38.5,54.75 51.75,54.75 v54.25,57.25
N$87
  Top 0.152: TOUCHCHOOSE6.1 142.75,43 142,43.75 142,45.5 141.75,45.75 FPCSENSOR6.3
N$88  (via drill 0.35)
  Top 0.152: 124.25,79 125.75,79 125.75,78 FPCSENSOR7.S2 | v124.5,80.75 124.25,80.5 FPCSENSOR7.6 124.25,79 | C8.1 122,74.5 121.75,74.75 FPCSENSOR7.1 121.75,77 | 121.75,77 120.25,77 120.25,78 FPCSENSOR7.S1 | 124.25,79 123.75,78.5 123.75,78.25 123.5,78 122.5,78 121.75,77.25 121.75,77
  Bottom 0.152: v124.5,80.75 125.5,79.75 LED7.3
N$89  (via drill 0.35)
  Top 0.152: 124,75.5 123.75,75.5 FPCSENSOR7.5 | 124,75.5 126.5,75.5 127.25,74.75 127.25,72.25 123.25,72.25 122,73.5 C8.2 | 124,75.5 v124,75.25
  Bottom 0.152: v124,75.25 121.5,75.25 120.5,76.25 LED7.1
N$90  (via drill 0.35)
  Top 0.152: v123.5,80.75 123.5,79.5 123.25,79.25 FPCSENSOR7.4
  Bottom 0.152: v123.5,80.75 123.5,76.75 125.25,76.75 125.5,76.5 LED7.4
N$93
  Top 0.152: TOUCHCHOOSE7.1 123.75,74 123.25,74.5 123.25,76.25 122.75,76.75 FPCSENSOR7.3
N$94  (via drill 0.35)
  Top 0.152: v163.25,79.25 162,78 FPCSENSOR8.S2 161.75,78 161.75,79 160.25,79 FPCSENSOR8.6 160.25,80.25 159.75,80.75 157.75,80.75 157.75,77 | C9.1 158,74.5 157.75,74.75 FPCSENSOR8.1 157.75,77 | 157.75,77 156.25,77 156.25,78 FPCSENSOR8.S1
  Bottom 0.152: v163.25,79.25 162,79.25 161.75,79.5 LED8.3
N$95  (via drill 0.35)
  Top 0.152: v158,72.75 C9.2 | v159.75,75.25 FPCSENSOR8.5
  Bottom 0.152: 158,75.25 158,76.25 156.5,76.25 LED8.1 | 158,75.25 v158,72.75 | 158,75.25 v159.75,75.25
N$96  (via drill 0.35)
  Top 0.152: v160.5,77.5 159.75,78.25 159.75,78.5 159.25,79 FPCSENSOR8.4
  Bottom 0.152: v160.5,77.5 161.5,76.5 LED8.4
N$99
  Top 0.152: TOUCHCHOOSE8.1 158.5,74 158.5,76.5 158.75,76.75 FPCSENSOR8.3
N$100  (via drill 0.35)
  Top 0.152: 107.25,108 108.75,108 108.75,107 FPCSENSOR9.S2 | v107.5,109.75 107.25,109.5 FPCSENSOR9.6 107.25,108 | 104.75,103.25 FPCSENSOR9.1 104.75,106 103.25,106 103.25,107 FPCSENSOR9.S1 | 104.75,103.25 104.75,102.75 105,102.5 C10.1 | 107.25,108 106.75,107.5 106.75,107.25 106.25,106.75 106.25,104.75 104.75,103.25
  Bottom 0.152: v107.5,109.75 108.5,108.75 LED9.3
N$101  (via drill 0.35)
  Top 0.152: FPCSENSOR9.5 v106.75,104.25 106.75,103.25 106.25,102.75 106.25,101.5 105,101.5 C10.2
  Bottom 0.152: v106.75,104.25 104.5,104.25 103.5,105.25 LED9.1
N$102  (via drill 0.35)
  Top 0.152: v106.5,109.75 106.5,108.5 106.25,108.25 FPCSENSOR9.4
  Bottom 0.152: v106.5,109.75 106.5,105.5 108.5,105.5 LED9.4
N$105
  Top 0.152: FPCSENSOR9.3 105.75,106.25 104.75,107.25 104.75,111.25 107.75,111.25 110.5,108.5 110.5,106 107.25,102.75 107.25,102.25 107,102 TOUCHCHOOSE9.1
N$106  (via drill 0.35)
  Top 0.152: 142.25,107 143.75,107 143.75,106 FPCSENSOR10.S2 144,106 v145.25,107.25 | 140.25,104.25 140.25,102.75 140,102.5 C11.1 | 140.25,104.25 139.75,104.75 FPCSENSOR10.1 139.75,105 138.25,105 138.25,106 FPCSENSOR10.S1 | 142.25,107 141.75,106.5 141.75,106.25 141.5,106 140.25,106 140.25,104.25 | 142.25,107 FPCSENSOR10.6
  Bottom 0.152: v145.25,107.25 144,107.25 143.75,107.5 LED10.3
N$107  (via drill 0.35)
  Top 0.152: v141,101.75 140,101.75 C11.2 | v141.75,103.25 FPCSENSOR10.5
  Bottom 0.152: 141,103.25 141,104.25 138.5,104.25 LED10.1 | 141,103.25 v141,101.75 | 141,103.25 v141.75,103.25
N$108  (via drill 0.35)
  Top 0.152: v141.25,108.75 FPCSENSOR10.4
  Bottom 0.152: v141.25,108.75 141.25,104.5 143.5,104.5 LED10.4
N$111
  Top 0.152: TOUCHCHOOSE10.1 141.75,102 141,102.75 141,104.5 140.75,104.75 FPCSENSOR10.3
N$112  (via drill 0.35)
  Top 0.152: FPCSENSOR11.6 176.25,108 177.75,108 177.75,107 FPCSENSOR11.S2 178,107 v178,109 177.25,109.75 172.25,109.75 172.25,107 | C12.1 174,103.5 174.25,103.75 174.25,105.25 173.75,105.75 FPCSENSOR11.1 173.75,106 172.25,106 172.25,107 | 172.25,107 FPCSENSOR11.S1
  Bottom 0.152: v178,109 177,109 176.75,108.75 LED11.3
N$113  (via drill 0.35)
  Top 0.152: v175,102.75 174,102.75 C12.2 | v176.75,104.25 176.75,104.75 175.75,105.75 FPCSENSOR11.5
  Bottom 0.152: 175,103.5 175,105.25 171.5,105.25 LED11.1 | 175,103.5 v175,102.75 | v176.75,104.25 176,103.5 175,103.5
N$114  (via drill 0.35)
  Top 0.152: FPCSENSOR11.4 175.25,104.75 v175.75,104.25
  Bottom 0.152: v175.75,104.25 176.75,105.25 LED11.4
N$117
  Top 0.152: FPCSENSOR11.3 174.75,104.75 175,104.5 175,103.75 175.75,103 TOUCHCHOOSE11.1
OUTL
  Top 0.152: 55.5,44.75 55,45.25 55,46.75 56.75,48.5 57,48.5 57,48.75 R7.2 | 55.5,44.75 57.5,42.75 C23.1 | 55.5,44.75 51.5,40.75 51.5,39.25 51.25,39 DACORTEENSY.1
OUTR
  Top 0.152: R8.2 57,47 57.25,46.75 57.25,46 C18.1 57.25,45.75 59.5,43.5 59.5,41.5 53.25,35.25 16.25,35.25 16.25,41.25 18,43 19.25,43 J4.3
POT  (via drill 0.35)
  Top 0.152: v34.25,90.75 v35.25,91.75
  Bottom 0.152: v35.25,91.75 40.5,91.75 46.25,86 51.75,86 55.25,82.5 U$1.A12 | v34.25,90.75 27.25,90.75 20.5,84 VR1.P$2
SCK  (via drill 0.35)
  Top 0.152: v28.5,90 28.5,91.25 U5.6 | v53.75,71.5 53.25,71 v53.25,68
  Bottom 0.152: v28.5,90 30.75,87.75 30.75,79 44.75,79 47.75,76 48.25,76 52.5,71.75 53.25,71.75 53.5,71.5 v53.75,71.5 | v53.25,68 53.5,68.25 58.5,68.25 62,64.75 63,64.75 U$1.13
SCL  (via drill 0.35)
  Top 0.152: 26.25,70.5 25.75,71 25.75,71.25 R5.2 | 26.25,70.5 27.75,69 28,69 CAPSENSE0X5B.2 | v26.75,81 27.75,81 CAPSENSE0X5A.2 | 26.25,70.5 v26.5,70.75
  Bottom 0.152: v26.75,81 26.25,80.5 26.25,70.75 | 26.25,70.75 30.75,66.25 48.75,66.25 49.5,67 54.25,67 55,66.25 56,66.25 56.75,67 57.75,67 U$1.29 | 26.25,70.75 v26.5,70.75
SD  (via drill 0.35)
  Top 0.152: 50.25,47 50.25,47.25 50,47.5 50,48 | 50.25,47 50.25,44.75 R14.2 | 50,48 50,48.25 R15.2 50,48 | v39.25,50.25 38,50.25 U2.1 | 50.25,47 v50,47 | 50,48 51.5,49.5 51.5,51 U3.1
  Bottom 0.152: v39.25,50.25 41,48.5 48.5,48.5 v50,47
SDA  (via drill 0.35)
  Top 0.152: R6.2 25.75,68.5 28,68.5 CAPSENSE0X5B.3 28.25,68.5 28.75,68.5 v29.25,69 | v27,80 27.25,80.25 27.25,80.5 27.75,80.5 CAPSENSE0X5A.3
  Bottom 0.152: v27,80 27,71.25 v29.25,69 29.5,68.75 56.75,68.75 57.75,69.75 U$1.30
SENS0A  (1 unrouted)
SENS0B
  Top 0.152: CAPSENSE0X5B.8 29.5,67 29.5,66.75 28,65.25 25.75,65.25 25.5,65 21.25,65 21.25,76.5 13,84.75 8.75,84.75 8.75,109 7.25,110.5 5.75,110.5 5.75,111.75 5,112.5 4.5,112.5 FPCBOARD0.4
SENS0M  (via drill 0.35)
  Top 0.152: v23.75,77 27.75,77 29.25,78.5 29.25,79 CAPSENSE0X5A.8 | v3.5,118.5 4.25,119.25 4.5,119.25 4.5,119 TORM0.1
  Bottom 0.152: v23.75,77 22.5,78.25 19.75,78.25 17,81 17,94 16.75,94 15.75,95 15.75,110 4.75,110 3.5,111.25 v3.5,118.5
SENS0T  (1 unrouted)
SENS1A  (1 unrouted)
SENS1B  (via drill 0.35)
  Top 0.152: v30,66 30,67 CAPSENSE0X5B.9 | v11,94.5 11.25,94.75 11.25,111 12.25,112 12.25,112.5 12.5,112.75 13.25,112.75 FPCBOARD1.4
  Bottom 0.152: v30,66 22.75,73.25 21.5,73.25 16.5,78.25 16.5,80.25 10.5,86.25 10.5,94.5 v11,94.5
SENS1M  (1 unrouted)
SENS1T  (1 unrouted)
SENS2A  (1 unrouted)
SENS2B  (1 unrouted)
SENS2M  (via drill 0.35)
  Top 0.152: v33.5,91.5 33.25,91.25 33.25,78 31,78 30,79 CAPSENSE0X5A.10 | v21,110.25 20.25,111 20.25,118 21.5,119.25 22.25,119.25 TORM2.1
  Bottom 0.152: v33.5,91.5 20,105 20,110.25 v21,110.25
SENS2T  (1 unrouted)
SENS3A  (1 unrouted)
SENS3B  (via drill 0.35)
  Top 0.152: v31,67 31,67.75 CAPSENSE0X5B.11 | v34.75,68 34.5,68.25 34.5,82.25 34.25,82.5 34.25,89 36.5,91.25 36.5,109 35,110.5 33.5,110.5 33.5,112 33,112.5 32.5,112.5 FPCBOARD3.4
  Bottom 0.152: v31,67 32,68 v34.75,68
SENS3M
  Top 0.152: CAPSENSE0X5A.11 30.75,79.75 31.75,78.75 32.75,78.75 32.75,105.75 30,108.5 30,117.25 31.5,118.75 32.25,118.75 TORM3.1
SENS3T  (1 unrouted)
SENS4A  (1 unrouted)
SENS4B  (1 unrouted)
SENS4M  (1 unrouted)
SENS4T  (1 unrouted)
SENS5A  (1 unrouted)
SENS5B  (via drill 0.35)
  Top 0.152: v32.75,67 32.75,67.5 31.75,68.5 31,68.5 CAPSENSE0X5B.13 | v42.5,68 46,71.5 46,72 45.75,72.25 45.75,76.75 44.25,78.25 44.25,91.75 45.5,93 45.5,107.25 48,109.75 48,111.75 48.75,112.5 51,112.5 51,112.75 FPCBOARD5.4
  Bottom 0.152: v32.75,67 33,67.25 41.75,67.25 v42.5,68
SENS5M  (via drill 0.35)
  Top 0.152: v29.5,81 29.5,80.5 30.5,80.5 CAPSENSE0X5A.13 | v29.5,87 32.25,89.75 32.25,101 v32,101.25 | v46.5,110 47.5,111 47.5,116.25 51,119.75 51.25,119.75 51.25,119.5 TORM5.1
  Bottom 0.152: v29.5,87 v29.5,81 | v32,101.25 40.75,110 v46.5,110
SENS5T  (1 unrouted)
SENS6A  (1 unrouted)
SENS6B  (via drill 0.35)
  Top 0.152: v32,69.5 31.5,69 31,69 CAPSENSE0X5B.14 | v38,75.5 43.25,80.75 v43.25,101.25 | v57,110.25 59.25,112.5 60,112.5 FPCBOARD6.4
  Bottom 0.152: v38,75.5 v32,69.5 | v43.25,101.25 52.25,110.25 v57,110.25
SENS6M  (via drill 0.35)
  Top 0.152: v32,85.5 32.25,85.25 32.25,81.75 31.5,81 30.75,81 CAPSENSE0X5A.14 | v35.75,89.25 39,92.5 v39,111.5 | v59,118.75 59.75,119.5 60,119.5 60,119.25 TORM6.1
  Bottom 0.152: v35.75,89.25 v32,85.5 | v39,111.5 46.25,118.75 v59,118.75
SENS6T  (1 unrouted)
SENS7A  (1 unrouted)
SENS7B  (1 unrouted)
SENS7M  (1 unrouted)
SENS7T  (1 unrouted)
SENS8A  (1 unrouted)
SENS8B  (1 unrouted)
SENS8M  (via drill 0.35)
  Top 0.152: v31.5,83.5 30,82 CAPSENSE0X5A.16 | v36.5,88.5 40.5,92.5 v40.5,96.75 | v79,99 79.75,99.75 80,99.75 80,99.5 TORM8.1
  Bottom 0.152: v36.5,88.5 v31.5,83.5 | v40.5,96.75 43.75,100 78,100 v79,99
SENS8T  (1 unrouted)
SENS9A  (1 unrouted)
SENS9B  (via drill 0.35)
  Top 0.152: v39,61.25 39,61.75 32.75,68 32.75,71.25 30.75,71.25 30,70.5 30,70 CAPSENSE0X5B.17 | v59,61.25 60.25,62.5 71.5,62.5 71.5,73 79,80.5 79.5,80.5 FPCBOARD9.4
  Bottom 0.152: v59,61.25 v39,61.25
SENS9M  (1 unrouted)
SENS10A  (1 unrouted)
SENS10B
  Top 0.152: FPCBOARD10.4 79,68.5 77.5,68.5 72,63 72,59.5 41.75,59.5 33.25,68 33.25,71.75 30.25,71.75 29.5,71 29.5,70 CAPSENSE0X5B.18
SENS10M  (via drill 0.35)
  Top 0.152: v28,102.75 25.25,100 25.25,90 29.25,86 29.25,82 CAPSENSE0X5A.18 | v85.25,70.25 85,70 TORM10.1
  Bottom 0.152: v28,102.75 30.25,100.5 78.5,100.5 87.75,91.25 87.75,70.25 v85.25,70.25
SENS10T  (1 unrouted)
SENS11A  (1 unrouted)
SENS11B  (1 unrouted)
SENS11M  (1 unrouted)
SENS11T  (1 unrouted)
TOUCHB0
  Top 0.152: TOUCHCHOOSE0.1 20,14.25 19.75,14.5 19.75,16.25 FPCSENSOR0.3
TOUCHPAD0  (1 unrouted)
  Top 0.152: 21,22.25 19.75,22.25 18,20.5 18,19.75 19,18.75 FPCSENSOR0.2
  pour Bottom: 21,2 21,32 arc-90 36,17 arc-90
  pour Top: 21,32 21,2 arc90 36,17 arc90
TOUCHPAD1
  Top 0.152: FPCSENSOR1.2 53.25,19.25 53.5,19.5 53.5,20.25 55,21.75
  pour Bottom: 55,1 55,31 arc-90 70,16 arc-90
  pour Top: 55,31 55,1 arc90 70,16 arc90
TOUCHPAD2
  Top 0.152: 90,22.5 88.5,21 88.5,19.5 88.25,19.25 FPCSENSOR2.2
  pour Bottom: 90,2 90,32 arc-90 105,17 arc-90
  pour Top: 90,32 90,2 arc90 105,17 arc90
TOUCHPAD3
  Top 0.152: 125,23.5 123.5,22 123.5,20.5 123.25,20.25 FPCSENSOR3.2
  pour Bottom: 125,2 125,32 arc-90 140,17 arc-90
  pour Top: 125,32 125,2 arc90 140,17 arc90
TOUCHPAD4
  Top 0.152: 163,26 160,23 160,21.5 160.25,21.25 FPCSENSOR4.2
  pour Bottom: 163,4 163,34 arc-90 178,19 arc-90
  pour Top: 163,34 163,4 arc90 178,19 arc90
TOUCHPAD5  (1 unrouted)
  Top 0.152: 108,50.5 107,50.5 106.5,50 106.5,48.5 106.25,48.25 FPCSENSOR5.2
  pour Bottom: 108,31 108,61 arc-90 123,46 arc-90
  pour Top: 108,61 108,31 arc90 123,46 arc90
TOUCHPAD6
  Top 0.152: 143,51.5 141.5,50 141.5,48.5 141.25,48.25 FPCSENSOR6.2
  pour Bottom: 143,31 143,61 arc-90 158,46 arc-90
  pour Top: 143,61 143,31 arc90 158,46 arc90
TOUCHPAD7  (1 unrouted)
  Top 0.152: FPCSENSOR7.2 122.25,80.5 125,83.25
  pour Bottom: 125,61 125,91 arc-90 140,76 arc-90
  pour Top: 125,91 125,61 arc90 140,76 arc90
TOUCHPAD8  (1 unrouted)
  Top 0.152: FPCSENSOR8.2 158.25,79 158.75,78.5 158.75,78.25 159,78 159,77.88
  pour Bottom: 159,61 159,91 arc-90 174,76 arc-90
  pour Top: 159,91 159,61 arc90 174,76 arc90
TOUCHPAD9  (1 unrouted)
  Top 0.152: FPCSENSOR9.2 105.25,109.5 106.25,110.5 108,110.5
  pour Bottom: 108,91 108,121 arc-90 123,106 arc-90
  pour Top: 108,121 108,91 arc90 123,106 arc90
TOUCHPAD10
  Top 0.152: 142,110.5 140.5,109 140.5,107.5 140.25,107.25 FPCSENSOR10.2
  pour Bottom: 142,90 142,120 arc-90 157,105 arc-90
  pour Top: 142,120 142,90 arc90 157,105 arc90
TOUCHPAD11  (1 unrouted)
  Top 0.152: FPCSENSOR11.2 174.25,108.25 174.75,108.75 174.75,109.25 176,109.25 176,109.28
  pour Top: 176,120 176,90 arc90 191,105 arc90
  pour Bottom: 176,90 176,120 arc-90 191,105 arc-90
TOUCHPOINT0  (1 unrouted)
  pour Bottom: 19,32 19,2 arc-90 4,17 arc-90
  pour Top: 19,2 19,32 arc90 4,17 arc90
TOUCHPOINT1  (1 unrouted)
  pour Bottom: 53,31 53,1 arc-90 38,16 arc-90
  pour Top: 53,1 53,31 arc90 38,16 arc90
TOUCHPOINT2  (1 unrouted)
  pour Bottom: 88,32 88,2 arc-90 73,17 arc-90
  pour Top: 88,2 88,32 arc90 73,17 arc90
TOUCHPOINT3  (1 unrouted)
  pour Bottom: 123,32 123,2 arc-90 108,17 arc-90
  pour Top: 123,2 123,32 arc90 108,17 arc90
TOUCHPOINT4  (1 unrouted)
  pour Bottom: 161,34 161,4 arc-90 146,19 arc-90
  pour Top: 161,4 161,34 arc90 146,19 arc90
TOUCHPOINT5  (1 unrouted)
  pour Bottom: 106,61 106,31 arc-90 91,46 arc-90
  pour Top: 106,31 106,61 arc90 91,46 arc90
TOUCHPOINT6  (1 unrouted)
  pour Bottom: 141,61 141,31 arc-90 126,46 arc-90
  pour Top: 141,31 141,61 arc90 126,46 arc90
TOUCHPOINT7  (1 unrouted)
  pour Bottom: 123,91 123,61 arc-90 108,76 arc-90
  pour Top: 123,61 123,91 arc90 108,76 arc90
TOUCHPOINT8  (1 unrouted)
  pour Bottom: 157,91 157,61 arc-90 142,76 arc-90
  pour Top: 157,61 157,91 arc90 142,76 arc90
TOUCHPOINT9  (1 unrouted)
  pour Bottom: 106,121 106,91 arc-90 91,106 arc-90
  pour Top: 106,91 106,121 arc90 91,106 arc90
TOUCHPOINT10  (1 unrouted)
  pour Bottom: 140,120 140,90 arc-90 125,105 arc-90
  pour Top: 140,90 140,120 arc90 125,105 arc90
TOUCHPOINT11  (1 unrouted)
  pour Bottom: 174,120 174,90 arc-90 159,105 arc-90
  pour Top: 174,90 174,120 arc90 159,105 arc90
VCC  (via drill 0.35)
  Top 0.152: C27.1 33,56.75 v33.5,56.25 33.75,56 33.75,54 34.5,53.25 34.5,51.75 34.25,51.5 33.5,51.5 U2.6 | R14.1 48.25,44.75 48.25,48.25 R15.1 48.25,48.5 48.25,49.5 49.25,50.5 49.25,52.5 48.5,53.25 48,53.25 | 47,55.5 48,56.5 C30.1 | 47,55.5 47,55.25 48,54.25 48,53.25 | 48,53.25 48,52.75 47.75,52.5 47,52.5 U3.6 | 47,55.5 v46.75,55.75
  Bottom 0.152: v33.5,56.25 34,55.75 v46.75,55.75
VO+  (via drill 0.35)
  Top 0.152: 40.25,42.5 37.75,40 37.75,39 37.25,38.5 SPEAKER1.1 | 40.25,42.5 41.25,43.5 | 41.25,43.5 43.5,45.75 C32.1 | 37.75,45.5 36.25,47 C29.1 | 37.75,45.5 37.75,45 40.25,42.5 | v28.5,51.5 28.5,52.75 FB1.2 | v37,48.75 38,47.75 38,47.25 | 38,47.25 38,45.75 37.75,45.5 | FB3.2 40,54 40,52.75 40.25,52.5 40.25,51.5 40,51.25 40,49.25 38,47.25 | SPEAKER2.1 41.25,43.25 41.25,43.5
  Bottom 0.152: v28.5,51.5 31.25,48.75 v37,48.75
VO-  (via drill 0.35)
  Top 0.152: C31.1 40.5,47 v41.25,47.75 42,48.5 42,50.5 FB4.2 | 31.75,47.5 32.25,48 33,48 33.5,47.5 C28.1 | 31.75,47.5 28.75,47.5 28.75,49.5 FB2.2 | 31.75,47.5 31.75,41.5 33.5,39.75 33.5,38.5 SPEAKER1.2
  Bottom 0.152: 41.25,41 41.25,39 42,39 SPEAKER2.2 | 41.25,41 v41.25,47.75 | 41.25,41 36,41 33.5,38.5 SPEAKER1.2

## Text on the board
Top: TESTBOARD / ARVID&MARIE / SEPTEMBER 202
Bottom: TESTBOARD / ARVID&MARIE / SEPTEMBER 202